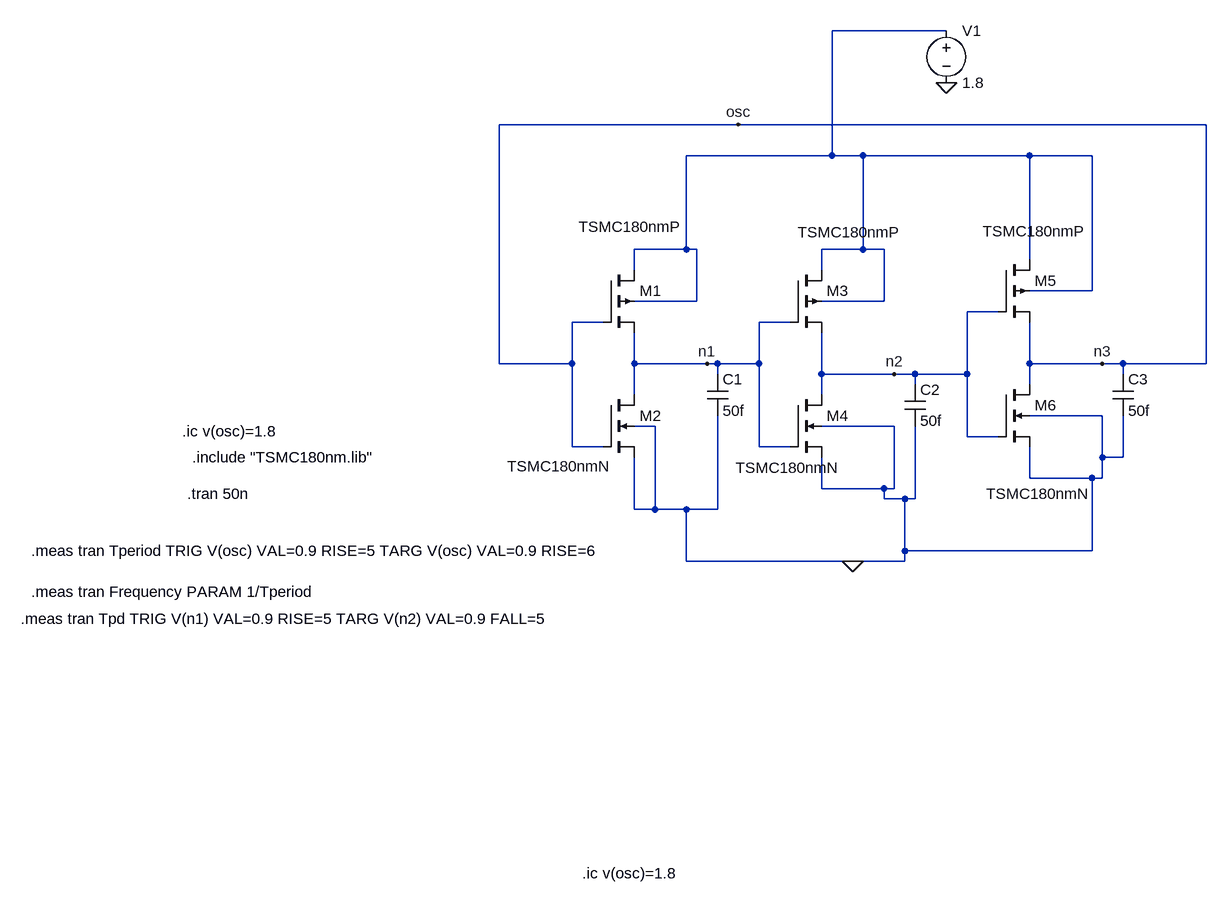
[diagram p0: schematic 3 Stage Ring Oscillator.asc]
3 Stage Ring Oscillator.asc, the LTspice schematic file:
Version 4.1
SHEET 1 880 944
WIRE 352 -368 176 -368
WIRE 32 -224 -336 -224
WIRE 752 -224 32 -224
WIRE 176 -176 176 -368
WIRE 176 -176 -48 -176
WIRE 224 -176 176 -176
WIRE 480 -176 224 -176
WIRE 576 -176 480 -176
WIRE -48 -32 -48 -176
WIRE -48 -32 -128 -32
WIRE -32 -32 -48 -32
WIRE 224 -32 224 -176
WIRE 224 -32 160 -32
WIRE 256 -32 224 -32
WIRE 480 -16 480 -176
WIRE -128 0 -128 -32
WIRE 160 0 160 -32
WIRE 576 32 576 -176
WIRE 576 32 480 32
WIRE -32 48 -32 -32
WIRE -32 48 -128 48
WIRE 256 48 256 -32
WIRE 256 48 160 48
WIRE 432 64 384 64
WIRE -176 80 -224 80
WIRE 112 80 64 80
WIRE -336 144 -336 -224
WIRE -224 144 -224 80
WIRE -224 144 -336 144
WIRE -128 144 -128 96
WIRE -16 144 -128 144
WIRE 0 144 -16 144
WIRE 64 144 64 80
WIRE 64 144 0 144
WIRE 480 144 480 80
WIRE 592 144 480 144
WIRE 624 144 592 144
WIRE 752 144 752 -224
WIRE 752 144 624 144
WIRE 0 160 0 144
WIRE 160 160 160 96
WIRE 272 160 160 160
WIRE 304 160 272 160
WIRE 384 160 384 64
WIRE 384 160 304 160
WIRE 624 160 624 144
WIRE 304 176 304 160
WIRE 480 176 480 144
WIRE -128 192 -128 144
WIRE 160 192 160 160
WIRE 592 224 480 224
WIRE -96 240 -128 240
WIRE 272 240 160 240
WIRE 384 256 384 160
WIRE 432 256 384 256
WIRE -224 272 -224 144
WIRE -176 272 -224 272
WIRE 64 272 64 144
WIRE 112 272 64 272
WIRE 592 288 592 224
WIRE 624 288 624 224
WIRE 624 288 592 288
WIRE 480 320 480 272
WIRE 576 320 480 320
WIRE 592 320 592 288
WIRE 592 320 576 320
WIRE 160 336 160 288
WIRE 256 336 160 336
WIRE 272 336 272 240
WIRE 272 336 256 336
WIRE 256 352 256 336
WIRE 288 352 256 352
WIRE 304 352 304 240
WIRE 304 352 288 352
WIRE -128 368 -128 288
WIRE -96 368 -96 240
WIRE -96 368 -128 368
WIRE -48 368 -96 368
WIRE 0 368 0 224
WIRE 0 368 -48 368
WIRE 288 432 288 352
WIRE 576 432 576 320
WIRE 576 432 288 432
WIRE -48 448 -48 368
WIRE 208 448 -48 448
WIRE 288 448 288 432
WIRE 288 448 208 448
FLAG -16 144 n1
FLAG 272 160 n2
FLAG 592 144 n3
FLAG 352 -288 0
FLAG 32 -224 osc
FLAG 208 448 0
SYMBOL pmos4 -176 0 R0
WINDOW 3 -38 -67 Left 2
SYMATTR Value TSMC180nmP
SYMATTR InstName M1
SYMATTR Value2 l=180n w=2u
SYMBOL nmos4 -176 192 R0
WINDOW 3 -148 110 Left 2
SYMATTR Value TSMC180nmN
SYMATTR InstName M2
SYMATTR Value2 l=180n w=1u
SYMBOL pmos4 112 0 R0
WINDOW 3 11 -58 Left 2
SYMATTR Value TSMC180nmP
SYMATTR InstName M3
SYMATTR Value2 l=180n w=2u
SYMBOL nmos4 112 192 R0
WINDOW 3 -84 112 Left 2
SYMATTR Value TSMC180nmN
SYMATTR InstName M4
SYMATTR Value2 l=180n w=1u
SYMBOL pmos4 432 -16 R0
WINDOW 3 -24 -44 Left 2
SYMATTR Value TSMC180nmP
SYMATTR InstName M5
SYMATTR Value2 l=180n w=2u
SYMBOL nmos4 432 176 R0
WINDOW 3 -19 168 Left 2
SYMATTR Value TSMC180nmN
SYMATTR InstName M6
SYMATTR Value2 l=180n w=1u
SYMBOL cap -16 160 R0
SYMATTR InstName C1
SYMATTR Value 50f
SYMBOL cap 288 176 R0
SYMATTR InstName C2
SYMATTR Value 50f
SYMBOL cap 608 160 R0
SYMATTR InstName C3
SYMATTR Value 50f
SYMBOL voltage 352 -384 R0
WINDOW 123 0 0 Left 0
WINDOW 39 0 0 Left 0
SYMATTR InstName V1
SYMATTR Value 1.8
TEXT -208 928 Left 2 !.ic v(osc)=1.8
TEXT -808 288 Left 2 !.include "TSMC180nm.lib"
TEXT -816 344 Left 2 !.tran 50n
TEXT -824 248 Left 2 !.ic v(osc)=1.8
TEXT -1056 432 Left 2 !.meas tran Tperiod TRIG V(osc) VAL=0.9 RISE=5 TARG V(osc) VAL=0.9 RISE=6\n \n.meas tran Frequency PARAM 1/Tperiod
TEXT -1072 536 Left 2 !.meas tran Tpd TRIG V(n1) VAL=0.9 RISE=5 TARG V(n2) VAL=0.9 FALL=5

The netlist it stands for:
* 3 Stage Ring Oscillator.asc
M1 N001 osc n1 N001 TSMC180nmP l=180n w=2u
M2 n1 osc 0 0 TSMC180nmN l=180n w=1u
M3 N001 n1 n2 N001 TSMC180nmP l=180n w=2u
M4 n2 n1 0 0 TSMC180nmN l=180n w=1u
M5 N001 n2 osc N001 TSMC180nmP l=180n w=2u
M6 osc n2 0 0 TSMC180nmN l=180n w=1u
C1 n1 0 50f
C2 n2 0 50f
C3 osc 0 50f
V1 N001 0 1.8
.model NMOS NMOS
.model PMOS PMOS
.lib standard.mos
.ic v(osc)=1.8
.include "TSMC180nm.lib"
.tran 50n
.ic v(osc)=1.8
.meas tran Tperiod TRIG V(osc) VAL=0.9 RISE=5 TARG V(osc) VAL=0.9 RISE=6
.meas tran Frequency PARAM 1/Tperiod
.meas tran Tpd TRIG V(n1) VAL=0.9 RISE=5 TARG V(n2) VAL=0.9 FALL=5
.backanno
.end